# EAGLE board mainboard_eurobotics2010_r4 (EAGLE 4.16)
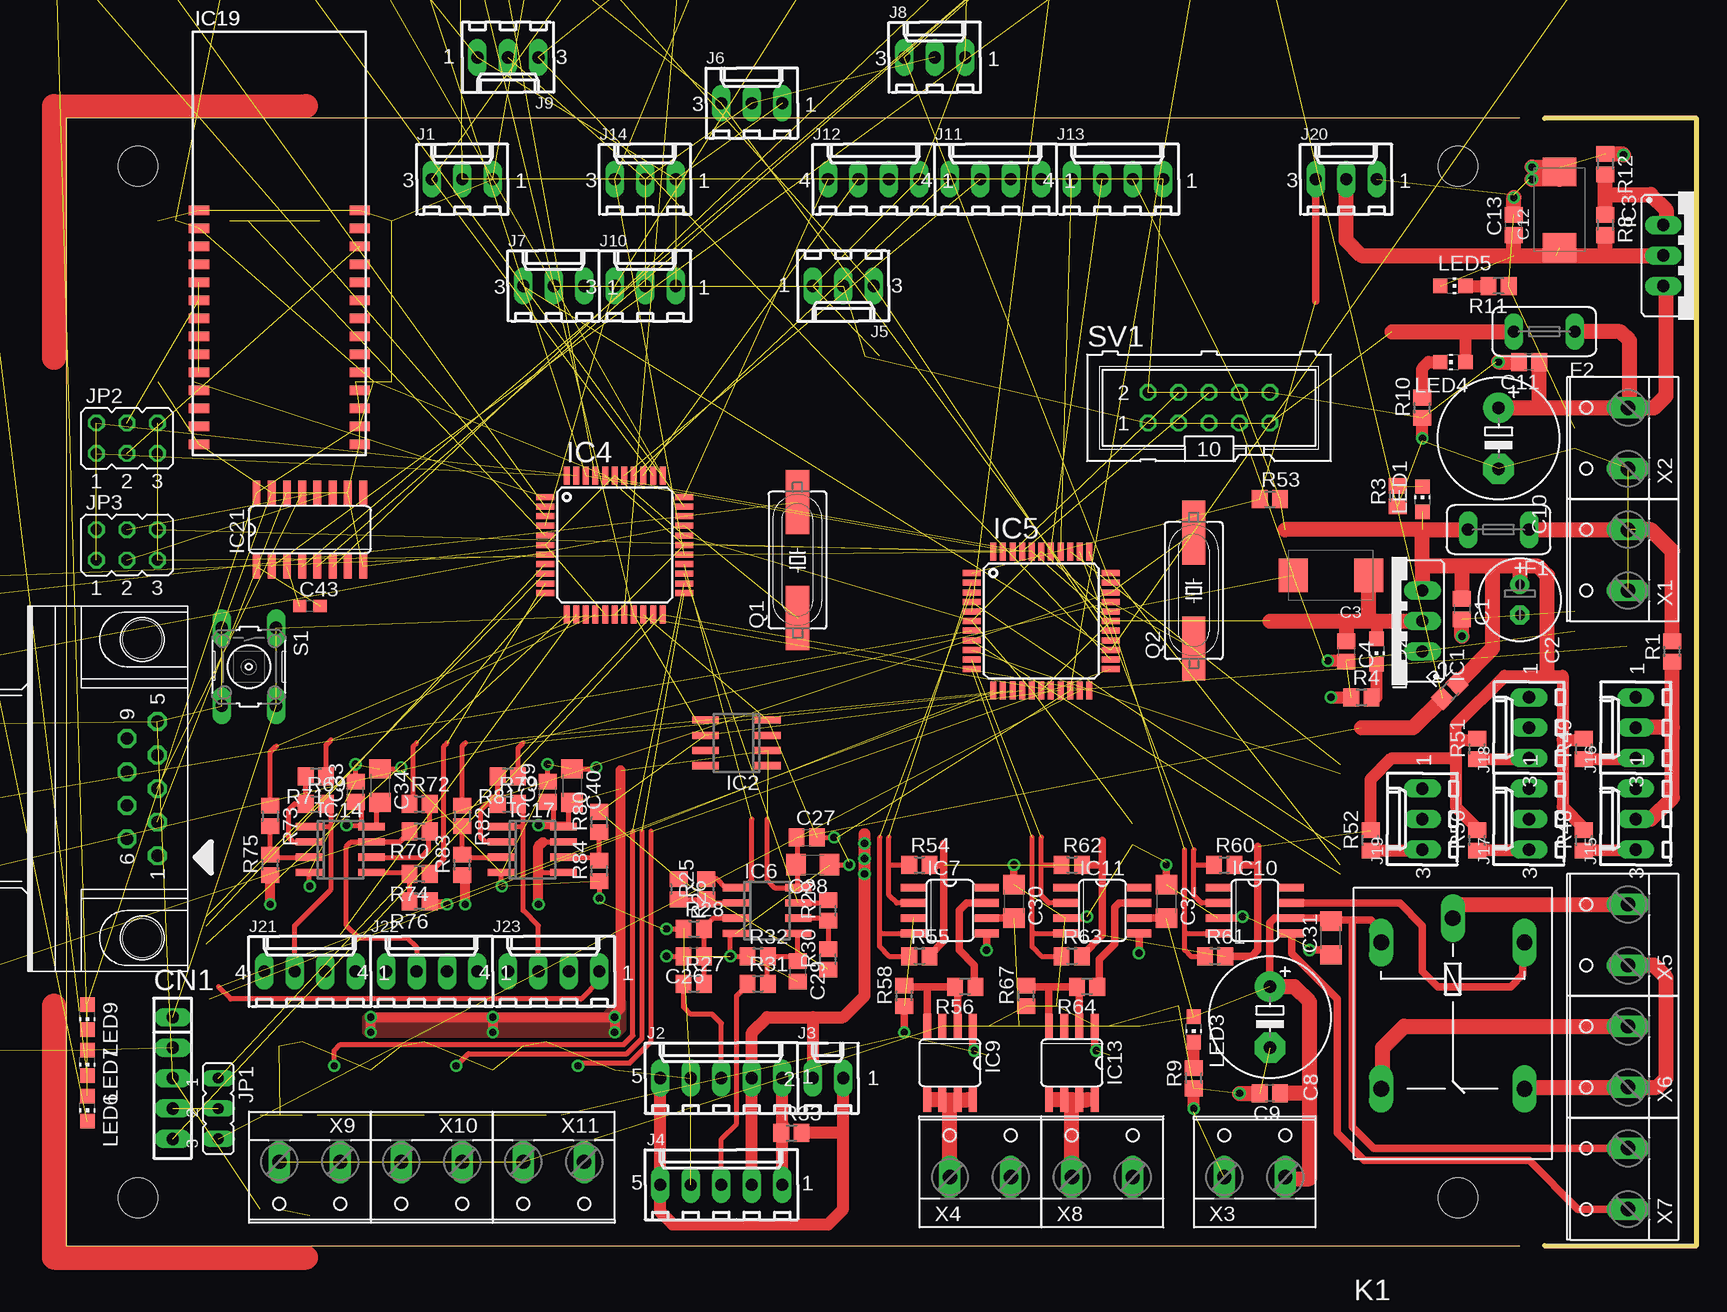
[diagram p9: board, top side]
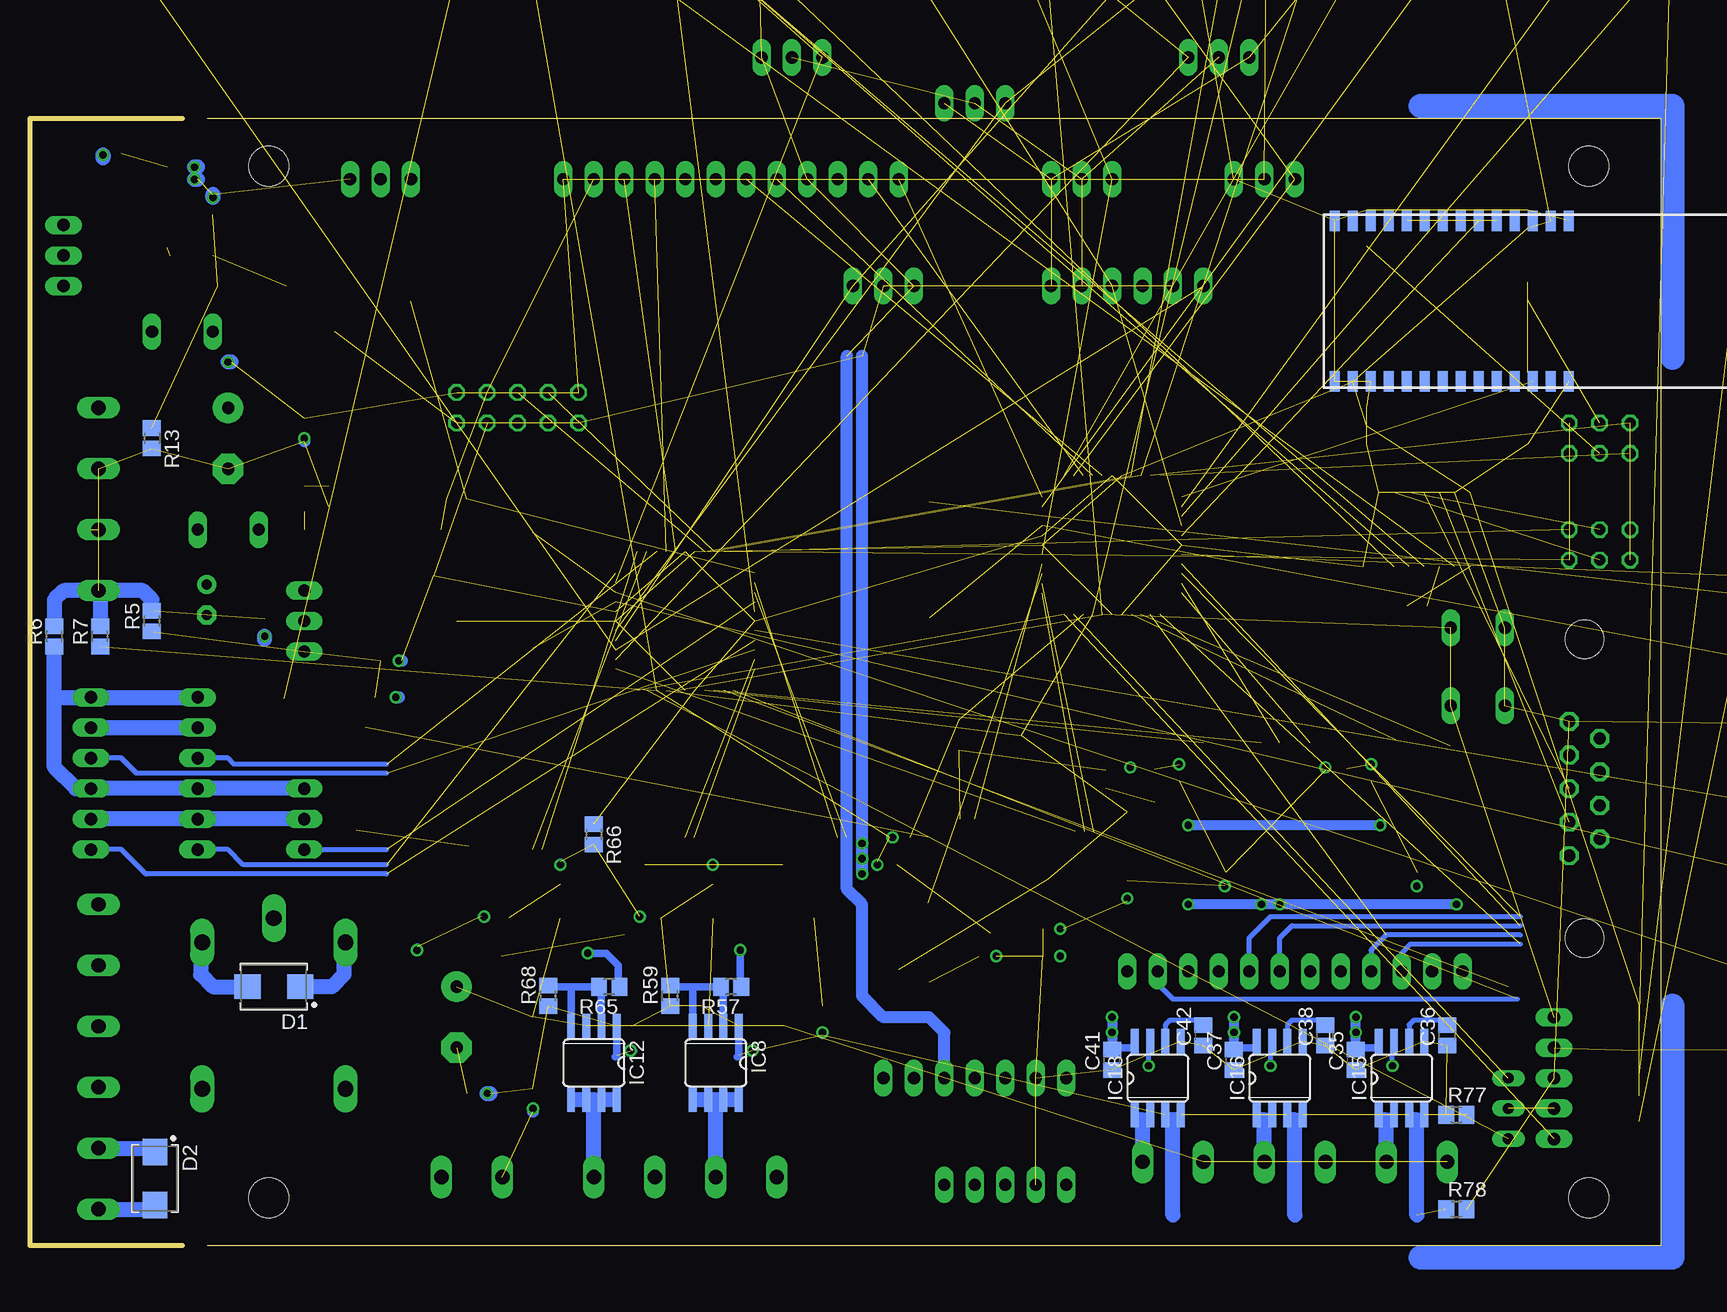
[diagram p10: board, bottom side, seen from below]

Size 135.89 x 94 mm. Coordinates in mm from the lower left corner, seen from the top.
Outline: 121.13,0 0,0 0,94 121.13,94
Outline: 123.19,0 135.89,0 135.89,93.98 123.19,93.98
Copper layers (1*16): Top 0.035mm / dielectric 1.5mm / Bottom 0.035mm
Design rules "olimex": minimum track width 10mil, minimum drill 24mil, track to track 8mil, track to pad 8mil, pad to pad 8mil, via to via 8mil, smd to smd 8mil, copper to edge 40mil, drill to drill 8mil, minimum pad ring 8mil, minimum via ring 8mil, stop-mask expansion 4mil, vias tented up to drill 0mil, thermal gap 10mil
Holes 3.3 mm at 6,4 116,4 6,90 116,90 172,110

## Footprints (pad centres in the part's own frame; a part is rotated, then mirrored left to right if it is on the bottom)
C0805 = smd 1.3 x 1.5: 1 -0.85,0; 2 0.85,0
E2,5-7 = drill 0.813 pad 1.6 round: + -1.27,0 | drill 0.813 pad 1.6 octagon: - 1.27,0
SMC_D = smd 2.4 x 2.8: + -3.15,0; - 3.15,0
C1206 = smd 1.6 x 1.8: 1 -1.4,0; 2 1.4,0
E5-10,5 = drill 1.016 pad 2.54 round: + -2.54,0 | drill 1.016 pad 2.54 octagon: - 2.54,0
C0603 = smd 1.1 x 1: 1 -0.85,0; 2 0.85,0
SMC_A = smd 1.6 x 1.4: + -1.5,0; - 1.5,0
SIP-100-5V = drill 1.016 long: 1 -5.08,0; 2 -2.54,0; 3 0,0; 4 2.54,0; 5 5.08,0
D-09F/90 = drill 1.016 pad 1.575 octagon: 1 -5.588,-1.27; 2 -2.794,-1.27; 3 0,-1.27; 4 2.794,-1.27; 5 5.588,-1.27; 6 -4.191,1.27; 7 -1.397,1.27; 8 1.397,1.27; 9 4.191,1.27 | hole 3.2: 12.446,0; -12.446,0
DIOM5436X265N = smd 2.2 x 2.05: A 2.2,0; K -2.2,0
TE5 = drill 1.016 long: 1 -2.54,0; 2 2.54,0
3,3 = hole 3.3: 0,0
317TS = drill 1.016 long: 1 -2.54,-2.54; 2 0,-2.54; 3 2.54,-2.54
SOIC8 = smd 0.6 x 2.2: 1 -1.905,-2.6; 2 -0.635,-2.6; 3 0.635,-2.6; 4 1.905,-2.6; 5 1.905,2.6; 6 0.635,2.6; 7 -0.635,2.6; 8 -1.905,2.6
TQFP44 = smd 1.5 x 0.5: 1 -5.8,4; 2 -5.8,3.2; 3 -5.8,2.4; 4 -5.8,1.6; 5 -5.8,0.8; 6 -5.8,0; 7 -5.8,-0.8; 8 -5.8,-1.6; 9 -5.8,-2.4; 10 -5.8,-3.2; 11 -5.8,-4; 23 5.8,-4; 24 5.8,-3.2; 25 5.8,-2.4; 26 5.8,-1.6; 27 5.8,-0.8; 28 5.8,0; 29 5.8,0.8; 30 5.8,1.6; 31 5.8,2.4; 32 5.8,3.2; 33 5.8,4 | smd 0.5 x 1.5: 12 -4,-5.8; 13 -3.2,-5.8; 14 -2.4,-5.8; 15 -1.6,-5.8; 16 -0.8,-5.8; 17 0,-5.8; 18 0.8,-5.8; 19 1.6,-5.8; 20 2.4,-5.8; 21 3.2,-5.8; 22 4,-5.8; 34 4,5.8; 35 3.2,5.8; 36 2.4,5.8; 37 1.6,5.8; 38 0.8,5.8; 39 0,5.8; 40 -0.8,5.8; 41 -1.6,5.8; 42 -2.4,5.8; 43 -3.2,5.8; 44 -4,5.8
SO08 = smd 0.6 x 2.2: 1 -1.905,-2.6; 2 -0.635,-2.6; 3 0.635,-2.6; 4 1.905,-2.6; 5 1.905,2.6; 6 0.635,2.6; 7 -0.635,2.6; 8 -1.905,2.6
SO08' = smd 0.66 x 2.032: 1 -1.905,-3.073; 2 -0.635,-3.073; 3 0.635,-3.073; 4 1.905,-3.073; 5 1.905,3.073; 6 0.635,3.073; 7 -0.635,3.073; 8 -1.905,3.073
WT11 = smd 1.7 x 0.8: 1 -6.7,2.5; 2 -6.7,1; 3 -6.7,-0.5; 4 -6.7,-2; 5 -6.7,-3.5; 6 -6.7,-5; 7 -6.7,-6.5; 8 -6.7,-8; 9 -6.7,-9.5; 10 -6.7,-11; 11 -6.7,-12.5; 12 -6.7,-14; 13 -6.7,-15.5; 14 -6.7,-17; 15 6.7,-17; 16 6.7,-15.5; 17 6.7,-14; 18 6.7,-12.5; 19 6.7,-11; 20 6.7,-9.5; 21 6.7,-8; 22 6.7,-6.5; 23 6.7,-5; 24 6.7,-3.5; 25 6.7,-2; 26 6.7,-0.5; 27 6.7,1; 28 6.7,2.5
SO16 = smd 0.66 x 2.032: 1 -4.445,-3.073; 2 -3.175,-3.073; 3 -1.905,-3.073; 4 -0.635,-3.073; 5 0.635,-3.073; 6 1.905,-3.073; 7 3.175,-3.073; 8 4.445,-3.073; 9 4.445,3.073; 10 3.175,3.073; 11 1.905,3.073; 12 0.635,3.073; 13 -0.635,3.073; 14 -1.905,3.073; 15 -3.175,3.073; 16 -4.445,3.073
6410-03 = drill 1.016 long: 1 2.54,0; 2 0,0; 3 -2.54,0
6410-05 = drill 1.016 long: 1 5.08,0; 2 2.54,0; 3 0,0; 4 -2.54,0; 5 -5.08,0
6410-02 = drill 1.016 long: 1 1.27,0; 2 -1.27,0
6410-04 = drill 1.016 long: 1 3.81,0; 2 1.27,0; 3 -1.27,0; 4 -3.81,0
JP2 = drill 0.914 long: 1 -2.54,0; 2 0,0; 3 2.54,0
JP3Q = drill 0.914 octagon: 1 -2.54,-1.27; 2 -2.54,1.27; 3 0,-1.27; 4 0,1.27; 5 2.54,-1.27; 6 2.54,1.27
G5LE = drill 1.321 long: 1 -7.493,-5.969; 2 -7.493,5.969; O 4.699,5.969; P -9.525,0; S 4.699,-5.969
CHIP-LED0805 = smd 1.2 x 1.2: A 0,-1.05; C 0,1.05
HC49UP = smd 5.334 x 1.93: 1 -4.826,0; 2 4.826,0
R0805 = smd 1.3 x 1.5: 1 -0.85,0; 2 0.85,0
B3F-10XX = drill 1.016 long: 1 -3.251,2.261; 2 3.251,2.261; 3 -3.251,-2.261; 4 3.251,-2.261
ML10 = drill 0.914 octagon: 1 -5.08,-1.27; 2 -5.08,1.27; 3 -2.54,-1.27; 4 -2.54,1.27; 5 0,-1.27; 6 0,1.27; 7 2.54,-1.27; 8 2.54,1.27; 9 5.08,-1.27; 10 5.08,1.27
W237-132 = drill 1.194 long: 1 -2.54,-0.635; 2 2.54,-0.635

## Placement (x,y rotation side)
C1  100nF  [C0805]  116.33,53.09 270 top
C2  220uF/10V  [E2,5-7]  121.16,53.85 270 top
C3  47uF/6V  [SMC_D]  105.41,55.88 180 top
C4  100nF  [C0805]  106.68,49.53 270 top
C5  10uF/10V  [C1206]  96.52,128.27 0 top  (outside the outline)
C6  100nF  [C0805]  31.75,167.64 0 top  (outside the outline)
C7  100nF  [C0805]  20.32,167.64 0 top  (outside the outline)
C8  220uF/35V  [E5-10,5]  100.33,19.05 270 top
C9  100nF  [C0805]  100.33,12.7 180 top
C10  220uF/35V  [E5-10,5]  119.38,67.31 270 top
C11  100nF  [C0805]  121.92,73.66 180 top
C12  47uF/16V  [SMC_D]  124.46,86.36 90 top
C13  100nF  [C0805]  120.65,85.09 90 top
C14  100nF  [C0603]  -36.83,39.37 0 top  (outside the outline)
C15  10uF/6V/lowESR  [SMC_A]  -36.83,54.61 0 top  (outside the outline)
C16  100nF  [C0603]  -36.83,46.99 0 top  (outside the outline)
C17  22pF  [C0805]  -36.83,43.18 0 top  (outside the outline)
C18  22pF  [C0805]  -36.83,50.8 0 top  (outside the outline)
C19  100nF  [C0603]  -36.83,35.56 0 top  (outside the outline)
C20  100nF  [C0603]  -36.83,27.94 0 top  (outside the outline)
C21  10uF/6V/lowESR  [SMC_A]  -36.83,31.75 0 top  (outside the outline)
C22  100nF  [C0603]  -36.83,16.51 0 top  (outside the outline)
C23  22pF  [C0805]  -36.83,24.13 0 top  (outside the outline)
C24  22pF  [C0805]  -36.83,12.7 0 top  (outside the outline)
C25  100nF  [C0603]  -36.83,20.32 0 top  (outside the outline)
C26  C1  [C0805]  52.32,24.13 180 top
C27  100nF  [C0805]  61.72,34.04 0 top
C28  10uF/10V  [C1206]  62.23,31.75 180 top
C29  C1  [C0805]  60.96,22.86 270 top
C30  10uF/35V  [C1206]  78.99,28.7 270 top
C31  10uF/35V  [C1206]  105.41,25.65 90 top
C32  10uF/35V  [C1206]  91.69,28.7 270 top
C33  100nF  [C0805]  24.13,37.85 90 top
C34  10uF/10V  [C1206]  26.16,38.35 270 top
C35  100nF  [C0805]  25.4,15.49 90 bottom
C36  100nF  [C0805]  17.78,17.53 90 bottom
C37  100nF  [C0805]  35.56,15.49 90 bottom
C38  100nF  [C0805]  27.94,17.53 90 bottom
C39  100nF  [C0805]  40.13,37.85 90 top
C40  10uF/10V  [C1206]  42.16,38.35 270 top
C41  100nF  [C0805]  45.72,15.49 90 bottom
C42  100nF  [C0805]  38.1,17.53 90 bottom
C43  100nF  [C0603]  20.32,53.34 0 top
C44  100nF  [C0603]  180.34,175.26 0 top  (outside the outline)
C45  100nF  [C0603]  168.91,175.26 0 top  (outside the outline)
C46  100nF  [C0603]  157.48,175.26 0 top  (outside the outline)
C47  100nF  [C0603]  146.05,175.26 0 top  (outside the outline)
CN1  [SIP-100-5V]  8.89,13.97 270 top
CON1  [D-09F/90]  6.35,38.1 90 top
D1  SS24  [DIOM5436X265N]  115.57,21.59 180 bottom
D2  SS24  [DIOM5436X265N]  125.48,5.59 270 bottom
F1  FUSETE5  [TE5]  119.38,59.69 180 top
F2  FUSETE5  [TE5]  123.19,76.2 180 top
H1  MOUNT-HOLE3.3  [3,3]  -39.37,-10.16 0 top  (outside the outline)
H2  MOUNT-HOLE3.3  [3,3]  -39.37,-19.05 0 top  (outside the outline)
H3  MOUNT-HOLE3.3  [3,3]  -39.37,-27.94 0 top  (outside the outline)
H4  MOUNT-HOLE3.3  [3,3]  -39.37,-36.83 0 top  (outside the outline)
H5  MOUNT-HOLE3.3  [3,3]  -39.37,-45.72 0 top  (outside the outline)
H6  MOUNT-HOLE3.3  [3,3]  -39.37,-54.61 0 top  (outside the outline)
H7  MOUNT-HOLE3.3  [3,3]  -39.37,-63.5 0 top  (outside the outline)
H8  MOUNT-HOLE3.3  [3,3]  -39.37,-72.39 0 top  (outside the outline)
IC1  LM1086CT-3.3  [317TS]  110.49,52.07 90 top
IC2  ADR443BRZ-R-8  [SOIC8]  55.88,41.91 90 top
IC3  LM338T  [317TS]  135.64,82.55 270 top
IC4  DSPIC33FJXXMC804SMD  [TQFP44]  45.72,58.42 0 top
IC5  DSPIC33FJXXMC804SMD  [TQFP44]  81.28,52.07 0 top
IC6  MCP6022SN  [SO08]  58.42,27.94 270 top
IC7  TC4427  [SO08']  73.66,27.94 270 top
IC8  IRF7389  [SO08']  78.74,15.24 180 bottom
IC9  IRF7389  [SO08']  73.66,15.24 180 top
IC10  TC4427  [SO08']  99.06,27.94 270 top
IC11  TC4427  [SO08']  86.36,27.94 270 top
IC12  IRF7389  [SO08']  88.9,15.24 180 bottom
IC13  IRF7389  [SO08']  83.82,15.24 180 top
IC14  MCP6022SN  [SO08]  22.86,33.02 270 top
IC15  ADS713  [SO08']  21.59,13.97 0 bottom
IC16  ADS713  [SO08']  31.75,13.97 0 bottom
IC17  MCP6022SN  [SO08]  38.86,33.02 270 top
IC18  ADS713  [SO08']  41.91,13.97 0 bottom
IC19  WT11A  [WT11]  17.78,83.82 0 top
IC20  WT11A  [WT11]  10.16,78.74 270 bottom
IC21  MAX232ACSE  [SO16]  20.32,59.69 0 top
J1  [6410-03]  33.02,88.9 0 top
J2  [6410-05]  54.61,13.97 0 top
J3  [6410-02]  63.5,13.97 0 top
J4  [6410-05]  54.61,5.08 0 top
J5  [6410-03]  64.77,80.01 180 top
J6  [6410-03]  57.15,95.25 0 top
J7  [6410-03]  40.64,80.01 0 top
J8  [6410-03]  72.39,99.06 0 top  (outside the outline)
J9  [6410-03]  36.83,99.06 180 top  (outside the outline)
J10  [6410-03]  48.26,80.01 0 top
J11  [6410-04]  77.47,88.9 0 top
J12  [6410-04]  67.31,88.9 0 top
J13  [6410-04]  87.63,88.9 0 top
J14  [6410-03]  48.26,88.9 0 top
J15  [6410-03]  130.81,35.56 90 top
J16  [6410-03]  130.81,43.18 90 top
J17  [6410-03]  121.92,35.56 90 top
J18  [6410-03]  121.92,43.18 90 top
J19  [6410-03]  113.03,35.56 90 top
J20  [6410-03]  106.68,88.9 0 top
J21  [6410-04]  20.32,22.86 0 top
J22  [6410-04]  30.48,22.86 0 top
J23  [6410-04]  40.64,22.86 0 top
JP1  [JP2]  12.7,11.43 270 top
JP2  [JP3Q]  5.08,67.31 0 top
JP3  [JP3Q]  5.08,58.42 0 top
K1  G5LE  [G5LE]  115.57,17.78 270 top
LED1  [CHIP-LED0805]  113.03,62.23 0 top
LED2  [CHIP-LED0805]  109.22,49.53 180 top
LED3  [CHIP-LED0805]  93.98,18.03 180 top
LED4  [CHIP-LED0805]  115.57,73.66 90 top
LED5  [CHIP-LED0805]  115.57,80.01 270 top
LED6  [CHIP-LED0805]  1.78,11.43 180 top
LED7  [CHIP-LED0805]  1.78,15.24 180 top
LED8  [CHIP-LED0805]  15.24,116.84 0 top  (outside the outline)
LED9  [CHIP-LED0805]  1.78,19.05 180 top
LED10  [CHIP-LED0805]  21.59,116.84 0 top  (outside the outline)
Q1  10MHz  [HC49UP]  60.96,57.15 90 top
Q2  10MHz  [HC49UP]  93.98,54.61 90 top
R1  0R  [R0805]  133.86,49.53 90 top
R2  0R  [R0805]  115.32,46.23 45 top
R3  470R  [R0805]  111,62.48 90 top
R4  270R  [R0805]  107.95,45.72 0 top
R5  0R  [R0805]  125.73,52.07 90 bottom
R6  0R  [R0805]  133.86,50.8 90 bottom
R7  0R  [R0805]  130.05,50.8 90 bottom
R8  240R/1%  [R0805]  128.27,85.09 270 top
R9  2K7  [R0805]  93.98,13.97 90 top
R10  1K  [R0805]  113.03,69.85 90 top
R11  1K  [R0805]  119.38,80.01 180 top
R12  1K6/1%  [R0805]  128.27,90.17 270 top
R13  0R  [R0805]  125.73,67.31 270 bottom
R14  270R  [R0805]  -25.4,137.16 0 top  (outside the outline)
R15  270R  [R0805]  -13.97,137.16 0 top  (outside the outline)
R16  4K7  [R0805]  20.32,137.16 0 top  (outside the outline)
R17  4K7  [R0805]  31.75,137.16 0 top  (outside the outline)
R18  270R  [R0805]  8.89,137.16 0 top  (outside the outline)
R19  270R  [R0805]  -2.54,137.16 0 top  (outside the outline)
R20  0R  [R0805]  43.18,137.16 0 top  (outside the outline)
R21  10K  [R0805]  54.61,137.16 0 top  (outside the outline)
R22  4K7  [R0805]  66.04,137.16 0 top  (outside the outline)
R23  270R  [R0805]  88.9,152.4 0 top  (outside the outline)
R24  0R  [R0805]  77.47,152.4 0 top  (outside the outline)
R25  RD  [R0805]  53.34,29.72 90 top
R26  RC  [R0805]  51.05,29.72 270 top
R27  RA  [R0805]  52.32,21.84 0 top
R28  RB  [R0805]  52.32,26.42 0 top
R29  RD  [R0805]  63.5,27.94 90 top
R30  RC  [R0805]  63.5,23.88 90 top
R31  RA  [R0805]  57.66,21.84 0 top
R32  RB  [R0805]  57.66,24.13 0 top
R33  10K  [R0805]  60.45,9.4 0 top
R34  4K7  [R0805]  -13.97,160.02 0 top  (outside the outline)
R35  4K7  [R0805]  -2.54,160.02 0 top  (outside the outline)
R36  4K7  [R0805]  -36.83,160.02 0 top  (outside the outline)
R37  4K7  [R0805]  -25.4,160.02 0 top  (outside the outline)
R38  4K7  [R0805]  168.91,167.64 0 top  (outside the outline)
R39  4K7  [R0805]  180.34,167.64 0 top  (outside the outline)
R40  4K7  [R0805]  146.05,167.64 0 top  (outside the outline)
R41  4K7  [R0805]  157.48,167.64 0 top  (outside the outline)
R42  4K7  [R0805]  123.19,167.64 0 top  (outside the outline)
R43  4K7  [R0805]  134.62,167.64 0 top  (outside the outline)
R44  4K7  [R0805]  100.33,167.64 0 top  (outside the outline)
R45  4K7  [R0805]  111.76,167.64 0 top  (outside the outline)
R46  4K7  [R0805]  77.47,167.64 0 top  (outside the outline)
R47  4K7  [R0805]  88.9,167.64 0 top  (outside the outline)
R48  4K7  [R0805]  126.49,33.78 90 top
R49  4K7  [R0805]  126.49,41.4 90 top
R50  4K7  [R0805]  117.6,33.78 90 top
R51  4K7  [R0805]  117.6,41.4 90 top
R52  4K7  [R0805]  108.71,33.78 90 top
R53  4K7  [R0805]  100.33,62.23 0 top
R54  2K2  [R0805]  71.12,31.75 0 top
R55  2K2  [R0805]  71.12,24.13 0 top
R56  22R  [R0805]  74.93,21.59 180 top
R57  22R  [R0805]  77.47,21.59 180 bottom
R58  2K2  [R0805]  69.85,20.83 90 top
R59  2K2  [R0805]  82.55,20.83 90 bottom
R60  2K2  [R0805]  96.52,31.75 0 top
R61  2K2  [R0805]  95.76,24.13 0 top
R62  2K2  [R0805]  83.82,31.75 0 top
R63  2K2  [R0805]  83.82,24.13 0 top
R64  22R  [R0805]  85.09,21.59 180 top
R65  22R  [R0805]  87.63,21.59 180 bottom
R66  0R  [R0805]  88.9,34.29 270 bottom
R67  2K2  [R0805]  80.01,20.83 90 top
R68  2K2  [R0805]  92.71,20.83 90 bottom
R69  2K/1%  [R0805]  20.83,36.83 0 top
R70  2K/1%  [R0805]  29.46,34.54 180 top
R71  1K/1%  [R0805]  20.83,39.12 180 top
R72  1K/1%  [R0805]  29.46,36.83 0 top
R73  1K/1%  [R0805]  17.02,35.81 270 top
R74  1K/1%  [R0805]  29.46,30.99 180 top
R75  2K/1%  [R0805]  17.02,31.75 90 top
R76  2K/1%  [R0805]  29.46,28.7 180 top
R77  0R  [R0805]  17.02,10.92 0 bottom
R78  0R  [R0805]  17.02,3.05 0 bottom
R79  2K/1%  [R0805]  36.83,36.83 0 top
R80  1K/1%  [R0805]  44.45,35.31 90 top
R81  1K/1%  [R0805]  36.83,39.12 180 top
R82  1K/1%  [R0805]  33.02,35.81 270 top
R83  2K/1%  [R0805]  33.02,31.75 90 top
R84  2K/1%  [R0805]  44.45,31.24 90 top
S1  [B3F-10XX]  15.24,48.26 270 top
SV1  [ML10]  95.25,69.85 0 top
X1  [W237-132]  129.54,57.15 90 top
X2  [W237-132]  129.54,67.31 90 top
X3  [W237-132]  99.06,6.35 0 top
X4  [W237-132]  76.2,6.35 0 top
X5  [W237-132]  129.54,25.91 90 top
X6  [W237-132]  129.54,15.75 90 top
X7  [W237-132]  129.54,5.59 90 top
X8  [W237-132]  86.36,6.35 0 top
X9  [W237-132]  20.32,6.35 180 top
X10  [W237-132]  30.48,6.35 180 top
X11  [W237-132]  40.64,6.35 180 top

## Tracks (layer width: path | path; a pad name or v marks a point on that pad's centre or on a via)
0V  (via drill 0.61)  (23 unrouted)
  Top 0.61: IC10.3 98.17,27.3 v98.04,27.43 | IC9.1 75.56,16.38 v75.69,16.26 | v69.85,17.78 R58.1 | C31.1 105.41,24.38 105.16,24.64 v103.63,24.64 | C32.1 v91.69,31.75 | IC13.1 85.72,16.38 v85.85,16.26 | C30.1 v78.99,31.75 | IC11.3 84.96,27.3 v85.09,27.43
  Top 1.016: v93.98,11.43 R9.1
  Top 1.27: v97.79,12.7 C9.2
  Bottom 0.406: IC15.4 19.79,10.9 19.81,10.92 19.84,10.9 IC15.3 20.34,10.9 20.32,10.92 20.32,10.16 | IC18.3 40.16,10.9 40.13,10.92 40.11,10.9 IC18.4 40.62,10.9 40.64,10.92 40.64,10.16 | IC16.4 30.96,10.9 30.99,10.92 31.01,10.9 IC16.3 30.5,10.9 30.48,10.92 30.48,10.16
  Bottom 0.61: v98.04,27.43 98.3,27.43 | v75.69,16.26 75.44,16.26 | IC8.1 76.83,15.88 76.96,15.75 | 69.85,17.53 v69.85,17.78 | v103.63,24.64 103.63,24.89 | v91.69,31.75 91.69,32 | v85.85,16.26 85.6,16.26 | IC12.1 87,15.88 87.12,15.75 | v78.99,31.75 78.99,32 | v85.09,27.43 84.84,27.43
  Bottom 1.016: v93.98,11.43 93.98,11.18
  Bottom 1.27: v97.79,12.7 97.54,12.7 | 20.32,2.54 20.32,10.16 | 40.64,2.54 40.64,10.16 | 30.48,2.54 30.48,10.16
+3V3  (26 unrouted)
  Top 1.016: 109.22,52.07 LED2.A
  Top 1.27: 100.33,52.07 106.68,52.07 | 106.68,52.07 108.46,52.07 | 108.46,52.07 109.22,52.07 IC1.2 | C3.+ 108.56,52.17 108.46,52.07 | 106.68,52.07 C4.1
+3V_VREF  (6 unrouted)
+5V  (20 unrouted)
  Top 0.61: R61.2 98.81,24.13 99.31,24.64 99.31,31.75 | 99.31,31.75 99.31,33.27 | 99.31,31.75 R60.2 | R55.2 71.97,24.22 73.15,25.4 73.15,31.75 | 73.15,31.75 73.15,33.53 | 71.88,31.75 R54.2 73.15,31.75 | R63.2 84.67,24.22 86.36,25.91 86.36,31.75 | 86.36,31.75 86.36,33.78 | 86.36,31.75 R62.2
  Top 1.016: R50.2 117.6,34.8 115.82,36.58 115.82,40.64 | 115.82,40.64 115.82,42.16 | R52.2 108.71,38.86 110.49,40.64 115.82,40.64 | R48.2 126.49,34.8 124.71,36.58 124.71,42.16 | 124.71,42.16 124.71,47.5 123.44,47.5 119.89,47.5 115.82,43.43 115.82,42.16 | R49.2 126.49,42.16 124.71,42.16 | R51.2 117.6,42.16 115.82,42.16
  Top 1.27: 113.03,59.69 101.6,59.69 | 113.03,59.69 F1.2 | 113.03,56.64 113.03,59.69 | 113.03,56.64 IC1.3 | 121.16,56.64 C2.+ | 116.33,56.64 113.03,56.64 | 116.33,56.64 C1.1 | R2.2 118.87,49.78 118.87,56.64 | 118.87,56.64 116.33,56.64 | 121.16,56.64 118.87,56.64 | 123.44,47.5 123.44,55.88 122.68,56.64 121.16,56.64
+5V_ANALOG  (via drill 0.61)  (6 unrouted)
  Top 0.406: 60.96,31.75 60.96,29.84 IC6.8 59.05,29.84 58.42,30.48 58.42,35.56 | C27.1 60.96,34.04 60.96,31.75 | 60.96,31.75 C28.2 | 25.91,35.05 25.78,34.92 IC14.8 24.77,34.92 24.64,35.05 24.64,36.58 24.22,37 C33.1 | 25.91,35.05 25.91,36.58 26.16,36.83 C34.2 26.03,36.95 25.91,36.83 25.91,35.05 | C39.1 40.22,37 40.64,36.58 40.64,35.05 40.77,34.92 IC17.8 41.78,34.92 41.91,35.05 41.91,36.32 | 41.91,36.32 41.91,36.58 42.16,36.83 C40.2 42.16,36.58 41.91,36.32 | v23.37,35.05 25.91,35.05
  Top 0.61: v39.37,35.05 41.91,35.05
  Top 0.813: v25.4,17.78 v25.4,19.05 v35.56,19.05 | v35.56,19.05 v35.56,17.78 | v35.56,19.05 v35.56,17.78 | v35.56,19.05 v35.56,17.78 | v45.72,19.05 v45.72,17.78 | v45.72,19.05 v45.72,17.78 | v35.56,19.05 v35.56,17.78 | v45.72,19.05 v45.72,17.78 | v45.72,19.05 v45.72,17.78 | v45.72,19.05 45.72,19.3 46.23,19.81 46.23,38.1 46.23,39.62 | v35.56,19.05 v45.72,19.05
  Top 1.27: R2.1 112.27,43.18 107.95,43.18
  Bottom 0.61: IC15.8 23.5,16.64 23.62,16.51 25.4,16.51 | IC16.8 33.66,16.64 33.78,16.51 35.56,16.51 | IC18.8 43.81,16.64 43.94,16.51 45.72,16.51
  Bottom 0.813: C35.2 25.4,16.51 v25.4,17.78 v25.4,19.05 | C37.2 35.56,16.51 v35.56,17.78 v35.56,19.05 | C41.2 45.72,16.51 v45.72,17.78 v45.72,19.05 | v23.37,35.05 v39.37,35.05
  pour Top: 46.48,20.32 46.48,18.03 45.97,17.53 25.15,17.53 24.89,17.78 24.89,19.05 25.15,19.3 44.96,19.3 45.97,20.32
+12V  (via drill 0.61)  (10 unrouted)
  Top 1.016: LED4.A 116.62,76.17 116.59,76.2 | J4.2 J2.2 57.15,17.78 58.42,19.05 62.23,19.05 | 62.23,19.05 64.77,19.05 66.55,20.83 v66.55,30.99 v66.55,32.26 v66.55,33.53 66.55,34.29 | 62.23,19.05 J3.2
  Top 1.27: 110.49,76.2 116.59,76.2 F2.2
  Bottom 1.016: v66.55,30.99 v66.55,32.26 v66.55,33.53 66.55,74.17
+24V  (10 unrouted)
  Top 0.61: C8.+ 100.33,26.92 100.71,27.3 IC10.6 105.28,27.3 105.41,27.18 | 105.92,26.67 105.53,27.05 C31.2 105.41,27.18 | K1.1 109.6,26.29 108.71,27.18 107.19,27.18 | 105.41,27.18 107.19,27.18 | 107.19,27.18 107.19,9.91 108.97,8.13 X7.2 130.3,8.13 | C32.2 | IC11.6 C32.2 | C32.2 91.69,27.43 | C30.2 78.99,27.43 78.87,27.3 IC7.6
  Top 1.016: X3.2 101.6,5.59
  Top 1.27: 103.63,12.7 103.63,5.59 101.6,5.59 | 103.63,12.7 103.63,20.32 102.36,21.59 C8.+ | 103.63,12.7 C9.1
  Bottom 1.27: D1.K 110.74,21.59 109.73,22.61 109.73,25.15 K1.1 | D2.K 125.48,8.13 X7.2
AGND  (via drill 0.61)  (33 unrouted)
  Top 0.406: C27.2 v64.01,34.04 | C28.1 v65.28,31.75 | v50.04,26.42 R28.1 | v50.04,24.13 C26.2 | R32.1 v55.37,24.13 55.37,25.91 55.5,26.04 IC6.4 | IC17.4 36.26,30.03 v36.32,29.97 | IC14.4 20.26,30.03 v20.32,29.97 | C39.2 v40.13,40.13 | C40.1 44.07,39.75 v44.2,39.88 | C34.1 27.82,39.75 v27.94,39.88 | C33.2 v24.13,40.13 | R84.1 v44.45,28.96
  Bottom 0.406: v64.01,34.04 64.26,34.04 | v65.28,31.75 65.28,32 | v50.04,26.42 49.78,26.42 | v50.04,24.13 49.78,24.13 | v55.37,24.13 55.37,24.38 | v36.32,29.97 36.07,29.97 | v20.32,29.97 20.07,29.97 | v40.13,40.13 40.13,40.39 | v44.2,39.88 44.2,39.62 | v27.94,39.88 27.94,39.62 | v24.13,40.13 24.13,40.39 | v44.45,28.96 44.45,28.7
ARM_ENC_CHA  (1 unrouted)
ARM_ENC_CHB  (1 unrouted)
ARM_MOT_BREAK  (1 unrouted)
  Top 0.406: J23.1 44.45,22.1 42.93,20.57 13.72,20.57 12.7,21.59
ARM_MOT_CURRENT  (via drill 0.61)  (1 unrouted)
  Top 0.406: v42.67,14.99 42.93,15.24 46.99,15.24 48.77,17.02 48.77,34.54
  Bottom 0.406: IC18.7 42.55,16.38 42.67,16.26 v42.67,14.99
ARM_MOT_REV  (1 unrouted)
  Bottom 0.406: J23.2 41.91,21.84 40.64,20.57 11.94,20.57
ARM_MOT_VREF_N  (1 unrouted)
  Top 0.406: R81.1 37.68,41.49 38.1,41.91
ARM_MOT_VREF_P  (1 unrouted)
  Top 0.406: R82.1 33.02,41.66 33.27,41.91
ARM_VREF
  Top 0.406: R79.2 37.59,36.83 38.1,36.32 38.1,35.05 | IC17.1 37.97,34.92 38.1,35.05 | 38.1,35.05 38.1,27.94 39.37,26.67 J23.3
BEACON_UART_RX  (1 unrouted)
BEACON_UART_TX  (1 unrouted)
COMPRESSOR_POWER  (1 unrouted)
  Top 0.406: IC10.2 94.61,28.57 93.98,29.21 93.98,31.75 | 93.98,31.75 93.98,33.02 | 93.98,31.75 R60.1
CORN_INSIDE_SENSOR  (3 unrouted)
CORN_PUSH_PWM_(5V)  (1 unrouted)
  Top 0.406: R52.1 108.71,33.02
  Top 1.016: R52.1 112.94,32.93 J19.3
  Bottom 0.406: J19.3 106.17,33.02
FROM_TX_RS232_M  (1 unrouted)
G_RST  (5 unrouted)
GND  (via drill 0.61)  (51 unrouted)
  Top 1.016: v105.41,45.72 R4.1 | C4.2 106.68,48.77 v105.16,48.77
  Bottom 1.016: v105.41,45.72 105.16,45.72 | v105.16,48.77 104.9,48.77
GND_SERVO_5V
  Bottom 1.27: 133.86,45.72 133.86,39.88 132.08,38.1 J15.1 J17.1 J19.1 | 133.86,45.72 R6.1 | 133.86,45.72 J16.1 J18.1
GND_SERVO_9.6V  (via drill 0.61)  (5 unrouted)
  Top 1.27: R12.1 129.71,91.02 v129.79,90.93 | C13.2 v120.65,87.38 | v122.17,88.9 124.46,88.9 C12.- 124.46,89.92 v122.17,89.92
  Bottom 1.27: v129.79,90.93 129.79,90.68 | v120.65,87.38 120.65,87.63 | v122.17,88.9 121.92,88.9 | v122.17,89.92 121.92,89.92
GNDIO  (via drill 0.61)  (28 unrouted)
  Top 1.016: v113.03,67.31 R10.1 | R33.1 59.69,9.4 59.69,10.16 | 59.69,10.16 J2.1 | J4.1 59.69,10.16
  Top 1.27: v119.38,73.66 C11.2 | v116.33,50.8 C1.2
  Bottom 1.016: v113.03,67.31 113.03,67.06 | J2.1 59.69,17.78 60.96,19.05 64.77,19.05 66.55,20.83 66.55,28.45 67.82,29.72 67.82,74.17
  Bottom 1.27: 119.13,73.66 v119.38,73.66 | 116.33,50.55 v116.33,50.8 | 130.05,54.61 R7.2 | R5.2 125.73,53.85 126.49,54.61 130.05,54.61 | 130.05,54.61 X1.1 133.1,54.61 133.86,53.85 R6.2
I2C_SCL_(5V)  (3 unrouted)
I2C_SDA_(5V)  (3 unrouted)
L_BALL_IN_SENSOR  (3 unrouted)
L_BALLS_LID_PWM_(5V)  (1 unrouted)
  Top 0.406: R49.1 126.49,40.64
  Top 1.016: R49.1 130.72,40.55 J16.3
  Bottom 0.406: J16.3 128.27,40.64 127,39.37 106.17,39.37
L_CORN_HOLD_PWM_(5V)  (1 unrouted)
  Top 0.406: R51.1 117.6,40.64
  Top 1.016: R51.1 121.83,40.55 J18.3
  Bottom 0.406: J18.3 119.38,40.64 118.87,40.13 106.17,40.13
L_CORN_MOT_INA_(5V)  (1 unrouted)
  Top 0.406: IC11.2 81.92,28.57 81.28,29.21 81.28,31.75 | 81.28,31.75 81.28,34.04 | 81.28,31.75 R62.1
L_CORN_MOT_INB_(5V)  (1 unrouted)
  Top 0.406: R63.1 81.28,24.13 80.52,24.89 80.52,26.16 | 80.52,26.16 80.52,34.04 | IC11.4 80.64,26.04 80.52,26.16
L_ENC_CHA  (1 unrouted)
L_ENC_CHB  (1 unrouted)
L_MOT_BREAK  (1 unrouted)
  Bottom 0.406: 11.68,25.91 22.86,25.91 24.13,24.64 J21.1
L_MOT_CURRENT  (via drill 0.61)  (1 unrouted)
  Top 0.406: 47.24,34.54 47.24,17.53 46.48,16.76 22.86,16.76 22.35,16.26 v22.35,14.99
  Bottom 0.406: IC15.7 22.23,16.13 22.35,16 v22.35,14.99
L_MOT_REV  (1 unrouted)
  Bottom 0.406: J21.2 21.59,24.38 20.83,25.15 11.68,25.15
L_MOT_VREF
  Top 0.406: R69.2 21.84,36.83 22.1,36.58 22.1,35.05 | IC14.1 21.97,34.92 22.1,35.05 | 22.1,35.05 22.1,29.72 19.05,26.67 J21.3
L_MOT_VREF_N  (1 unrouted)
  Top 0.406: R71.1 21.68,41.74 22.1,42.16
L_MOT_VREF_P  (1 unrouted)
  Top 0.406: R73.1 17.02,41.15 17.53,41.66
L_WALL_SENSOR  (3 unrouted)
LASER_BALL_SCAN  (1 unrouted)
  Top 0.406: 57.15,35.56 57.15,30.48 56.52,29.84 IC6.1 54.99,29.84 54.27,30.57 R25.2
LASER_CORN_SCAN  (1 unrouted)
  Top 0.406: IC6.7 63.5,28.57
  Top 0.61: 63.5,28.57 R29.2
MAIN_LED1  (1 unrouted)
MAIN_LED2  (1 unrouted)
MAIN_LED3  (1 unrouted)
MAIN_LED4  (1 unrouted)
MAIN_PGED  (1 unrouted)
MAIN_UART_RX  (2 unrouted)
MAIN_UART_TX  (2 unrouted)
N$1  (1 unrouted)
N$2
  Bottom 0.61: 77.22,12.19 77.19,12.17 IC8.8 | 77.98,12.19 77.72,12.19 | 80.64,12.06 IC8.5 80.29,12.17 80.26,12.19 80.24,12.17 | IC8.6 79.27,12.17 79.25,12.19 79.22,12.17 78.72,12.17
  Bottom 1.27: 78.72,12.17 78.51,12.17 | 78.51,12.17 IC8.7 | 78.51,12.17 77.98,12.19 | 78.72,12.17 78.74,11.94 X4.2 | 77.72,12.19 77.22,12.19 | 78.72,12.17 IC8.6 80.24,12.17
N$3
  Top 1.27: R8.1 128.27,87.63 | IC3.1 133.35,85.09 133.35,86.36 132.08,87.63 128.27,87.63 | 128.27,87.63 R12.2
N$4
  Top 0.61: IC9.8 75.46,12.17 75.44,12.19 75.16,12.17 | IC9.6 73.13,12.17 73.15,12.19 73.18,12.17 73.64,12.17 73.66,11.94 | IC9.5 71.86,12.17 71.88,12.19 72.16,12.17 | X4.1 73.66,5.59
  Top 1.27: 75.16,12.17 IC9.7 73.18,12.17 72.16,12.17 | X4.1 73.66,11.94
N$5
  Top 0.406: R27.1 51.47,19.9 52.07,19.3 53.85,19.3 54.61,18.54 J2.3
N$6
  Bottom 0.61: 80.77,21.59 R57.2 78.23,21.59 78.11,21.46 IC8.2 | R59.2 82.55,21.59 80.77,21.59 | IC8.4 80.64,21.46 80.77,21.59
N$7
  Top 0.61: IC9.2 74.3,21.46 74.17,21.59 | 74.17,21.59 R56.2 | R58.2 69.85,21.59 71.88,21.59 | 71.88,21.59 74.17,21.59 | IC9.4 71.75,21.46 71.88,21.59
N$8  (1 unrouted)
N$10  (1 unrouted)
N$11  (1 unrouted)
N$12
  Top 1.016: LED5.C R11.2
N$13  (1 unrouted)
N$14
  Top 0.61: IC7.7 75.06,28.57 74.42,27.94 74.42,24.64 75.69,23.37 75.69,21.84 75.78,21.76 R56.1
N$15  (via drill 0.61)
  Top 0.61: IC7.5 76.73,24.66 v76.71,24.64
  Bottom 0.61: 76.71,21.59 R57.1 76.62,21.76 76.71,21.84 v76.71,24.64
N$16  (1 unrouted)
N$17
  Bottom 0.61: IC12.6 89.64,12.17 89.66,12.19 89.69,12.17 | IC12.7 88.16,12.17 88.14,12.19 | 87.38,12.19 87.1,12.17 IC12.8 | IC12.5 90.45,12.17 90.42,12.19 90.4,12.17
  Bottom 1.27: 88.9,12.17 88.16,12.17 | 88.9,12.17 IC12.6 | 88.14,12.19 87.38,12.19 | 89.69,12.17 90.4,12.17 | X8.2 88.9,12.17
N$18
  Top 0.61: IC13.7 84.35,12.17 84.33,12.19 | IC13.6 83.08,12.17 83.06,12.19 | IC13.5 82.02,12.17 82.04,12.19 82.32,12.17 | IC13.8 85.57,12.17 85.34,12.19 85.11,12.17 | 83.82,12.17 83.82,12.19
  Top 1.27: 83.82,12.17 IC13.6 82.32,12.17 | 83.82,12.17 IC13.7 85.11,12.17 | X8.1 83.82,12.17
N$19
  Bottom 0.61: IC12.4 90.81,21.46 90.68,21.59 90.17,21.59 | 90.17,21.59 R65.2 88.39,21.59 88.27,21.46 IC12.2 | R68.2 92.71,21.59 90.17,21.59
N$20
  Top 0.61: IC13.2 84.45,21.46 84.33,21.59 | IC13.4 81.92,21.46 82.04,21.59 | 84.33,21.59 R64.2 | 82.04,21.59 84.33,21.59 | R67.2 80.18,21.68 80.26,21.59 82.04,21.59
N$21
  Top 0.61: IC11.7 87.76,28.57 87.38,28.19 87.38,25.15 86.11,23.88 86.11,21.84 85.94,21.68 R64.1
N$22  (via drill 0.61)
  Top 0.61: IC11.5 89.43,24.41 v89.41,24.38
  Bottom 0.61: v89.41,24.38 87.88,24.38 86.87,23.37 86.87,21.59 R65.1
N$23
  Top 0.61: IC10.7 111.12,28.57 113.03,26.67 113.03,22.86 114.3,21.59 120.4,21.59 121.41,22.61 121.41,25.15 K1.2
  Bottom 1.27: D1.A 120.65,21.59 121.67,22.61 121.67,24.89 121.41,25.15 K1.2
N$24
  Top 1.27: K1.O 121.67,13.21 X6.1 132.59,13.21 133.35,13.97 133.35,22.35 132.33,23.37 X5.1 130.05,23.37
N$25
  Top 2: 20,-1 -1,-1 -1,20
N$26
  Top 1.27: X5.2 115.57,28.45 K1.P
N$27  (1 unrouted)
N$29
  Top 2: 20,95 -1,95 -1,74
N$30  (1 unrouted)
N$31  (1 unrouted)
N$32  (1 unrouted)
N$33  (1 unrouted)
N$34  (1 unrouted)
N$35
  Top 1.27: X6.2 111.51,18.29 109.73,16.51 109.73,13.21 K1.S 109.47,12.95
N$36
  Top 0.406: IC6.2 53.72,28.57 53.43,28.87 R25.1 51.14,28.87 51.05,28.96 | 51.05,28.96 50.8,29.21 | R26.2 51.05,28.96
N$38
  Top 0.61: 130.3,3.05 X7.1 125.98,3.05 121.92,7.11 108.2,7.11 105.92,9.4 105.92,20.57 102.13,24.36 IC10.5
  Bottom 1.27: D2.A 125.64,3.39 125.98,3.05 X7.1
N$39
  Bottom 2: 20,-1 -1,-1 -1,20
N$40
  Top 0.406: R28.2 53.59,26.42 53.59,26.92 | R28.2 53.17,26.5 53.98,27.3 IC6.3 | R28.2 53.17,24.3 53.34,24.13 C26.1 53.17,21.76 | R27.2 53.17,21.76 | 53.17,21.76 53.34,21.59
N$42
  Bottom 2: 20,95 -1,95 -1,74
N$43
  Top 1.27: IC3.3 133.35,80.01 133.35,70.87 132.33,69.85 130.3,69.85 | C10.+ 122.68,69.85 | 122.68,69.85 X2.2 130.3,69.85 | F2.1 129.54,76.2 130.3,75.44 130.3,69.85 | C11.1 122.77,69.94 122.68,69.85
N$47  (2 unrouted)
N$48  (2 unrouted)
N$49  (1 unrouted)
N$50  (2 unrouted)
N$51  (2 unrouted)
N$52  (1 unrouted)
N$61
  Top 0.406: IC14.2 18.92,33.66 18.54,34.04 18.54,36.32 19.05,36.83 R69.1 20.07,36.83 19.98,36.92 R71.2
N$64  (1 unrouted)
N$65
  Top 1.016: R4.2 109.22,45.72 LED2.C
N$66
  Top 1.016: LED4.C 113.54,73.66 113.03,73.15 R10.2
N$67
  Top 1.016: R9.2 LED3.C
N$70
  Top 0.406: IC14.3 17.14,32.38 17.02,32.51 R75.2 R73.2 17.02,35.05
N$71
  Top 0.406: IC14.6 29.59,32.38 30.23,33.02 30.23,34.54 R70.1 30.31,36.66 30.48,36.83 R72.2
N$72
  Bottom 0.406: 23.6,10.9 IC15.1 | 22.86,10.9 IC15.2 | 22.86,10.9 23.6,10.9 | 23.6,10.9 23.62,10.92 | 22.86,10.16 22.86,10.9
  Bottom 1.27: X9.1 22.86,10.16
N$73
  Bottom 0.406: IC15.6 20.95,18.41 20.57,18.8 18.03,18.8 17.78,18.54 C36.2
N$74
  Top 0.406: IC14.5 28.32,31.11 28.45,30.99 R74.2 28.7,30.99 28.61,30.9 R76.2
N$75
  Top 0.406: IC17.6 44.07,32.38 44.45,32 R84.2 R80.1 44.45,34.54
N$76
  Bottom 0.406: IC16.1 33.55,10.9 33.53,10.92 33.5,10.9 | 33.5,10.9 IC16.2 | 33.5,10.9 33.05,10.9 33.02,10.92 33.02,10.16
  Bottom 1.27: X10.1 33.02,10.16
N$77
  Bottom 0.406: IC16.6 31.11,18.41 30.73,18.8 28.45,18.8 27.94,18.29 C38.2
N$78
  Bottom 0.406: IC18.1 43.71,10.9 43.69,10.92 43.66,10.9 | 43.66,10.9 IC18.2 | 43.66,10.9 43.2,10.9 43.18,10.92 43.18,10.16
  Bottom 1.27: 43.18,6.86 X11.1 43.18,10.16
N$79
  Bottom 0.406: C42.2 38.1,18.29 38.61,18.8 40.89,18.8 41.27,18.41 IC18.6
N$83
  Top 0.406: IC17.2 34.92,33.66 34.54,34.04 34.54,36.32 35.05,36.83 35.81,36.83 | 36.07,36.83 R79.1 35.81,36.83 | R81.2 35.98,37 35.81,36.83
N$84
  Top 0.406: R83.2 33.02,32.77 33.4,32.38 IC17.3 | R83.2 33.02,32.51 | R83.2 R82.2
N$92
  Top 1.016: 64.77,9.4 R33.2 | 64.77,9.4 J3.1 | J2.5 J4.5 49.53,2.79 50.55,1.78 63.5,1.78 64.77,3.05 64.77,9.4
N$93  (1 unrouted)
N$94
  Top 0.406: IC6.6 63.5,27.3 | R29.1 R30.2
  Top 0.61: 63.5,27.3 R29.1
N$95
  Top 0.406: 60.96,24.13 C29.1 | 60.96,24.13 R32.2 58.42,24.13 58.42,21.84 R31.2 | IC6.5 60.96,26.04 60.96,24.13
N$96
  Top 0.406: J4.3 54.61,8.89 55.88,10.16 55.88,20.83 56.9,21.84 R31.1
N$112  (1 unrouted)
  Top 1.27: F1.1 X1.2 | R1.2 133.86,57.91 132.08,59.69 130.81,59.69
PGEC  (2 unrouted)
PGED  (1 unrouted)
R_BALL_IN_SENSOR  (3 unrouted)
R_BALLS_LID_PWM_(5V)  (1 unrouted)
  Top 0.406: R48.1 126.49,33.02
  Top 1.016: R48.1 130.72,32.93 J15.3
  Bottom 0.406: J15.3 128.27,33.02 126.24,30.99 106.17,30.99
R_CORN_HOLD_PWM_(5V)  (1 unrouted)
  Top 0.406: R50.1 117.6,33.02
  Top 1.016: R50.1 121.83,32.93 J17.3
  Bottom 0.406: J17.3 119.38,33.02 118.11,31.75 106.17,31.75
R_CORN_MOT_INA_(5V)  (1 unrouted)
  Top 0.406: IC7.2 69.22,28.57 68.58,29.21 68.58,31.75 | 68.58,31.75 68.58,34.04 | 68.58,31.75 R54.1
R_CORN_MOT_INB_(5V)  (1 unrouted)
  Top 0.406: R55.1 68.58,24.13 67.82,24.89 67.82,26.16 | 67.82,26.16 67.82,34.04 | IC7.4 67.94,26.04 67.82,26.16
R_ENC_CHA  (1 unrouted)
R_ENC_CHB  (1 unrouted)
R_MOT_BREAK  (1 unrouted)
  Bottom 0.406: J22.1 34.29,25.65 32.51,27.43 11.68,27.43
R_MOT_CURRENT  (via drill 0.61)  (1 unrouted)
  Top 0.406: v32.51,14.99 33.53,16 46.74,16 48.01,17.27 48.01,34.54
  Bottom 0.406: IC16.7 32.38,16.38 32.51,16.26 v32.51,14.99
R_MOT_REV  (1 unrouted)
  Bottom 0.406: J22.2 31.75,25.65 30.73,26.67 11.68,26.67
R_MOT_VREF
  Top 0.406: R70.2 28.7,34.54 27.81,33.66 | 27.81,33.66 IC14.7 | J22.3 29.21,24.89 28.45,25.65 24.38,25.65 23.37,26.67 23.37,33.27 23.75,33.66 27.81,33.66
R_MOT_VREF_N  (1 unrouted)
  Top 0.406: R72.1 28.61,37 28.96,37.34 28.96,41.66 29.21,41.91
R_MOT_VREF_P  (1 unrouted)
  Top 0.406: 31.75,41.91 31.5,41.66 31.5,32.26 30.73,31.5 R74.1
R_WALL_SENSOR  (3 unrouted)
RX_MAX232  (1 unrouted)
RX_WT11  (1 unrouted)
SERVOS_UART_(5V)  (2 unrouted)
  Top 0.61: 104.14,78.74 J20.3
SLAVE_LED1  (1 unrouted)
SLAVE_PGED  (1 unrouted)
SLAVE_UART_RX  (2 unrouted)
SLAVE_UART_TX  (2 unrouted)
START  (2 unrouted)
SUCKER_OBJ_SENSOR  (3 unrouted)
TO_RX_RS232_M  (1 unrouted)
TX_MAX232  (1 unrouted)
TX_WT11  (1 unrouted)
VACUUM_REV  (1 unrouted)
  Top 0.406: R61.1 93.73,24.13 93.22,24.64 93.22,26.16 | 93.22,26.16 93.22,33.02 | IC10.4 93.34,26.04 93.22,26.16
VACUUM_SENSOR  (3 unrouted)
VCC_SERVO_5V
  Top 1.27: 133.86,43.18 133.86,37.34 132.08,35.56 J15.2 | 133.86,43.18 R1.1 | 133.86,43.18 J16.2
  Bottom 1.27: J16.2 J18.2 | J15.2 J17.2 J19.2
VCC_SERVO_9.6V  (2 unrouted)
  Top 1.27: 120.65,82.55 124.21,82.55 | 124.21,82.55 128.27,82.55 | 128.27,82.55 IC3.2 | 124.21,82.55 124.24,82.52 | 128.27,82.55 R8.2 | 120.65,82.55 C13.1 | 120.65,82.55 107.95,82.55 106.68,83.82 J20.2
VOFF_2V  (via drill 0.61)
  Top 0.406: 39.75,33.66 IC17.7 | IC17.5 39.75,31.11 39.37,31.24
  Top 0.61: R83.1 33.11,30.9 33.27,30.73 | R76.1 30.31,28.61 30.48,28.45
  Top 0.813: 39.75,33.66 39.37,33.27 39.37,31.24 v39.37,28.45 | v17.02,28.45 R75.1 | v33.27,28.45 33.27,30.73 | v31.75,28.45 30.48,28.45
  Bottom 0.813: v17.02,28.45 v31.75,28.45 v33.27,28.45 v39.37,28.45